# Altium schematic sheet Voeding.SchDoc: VoedingsSchema
size A4; DrawnBy: Jasper Maes; DocumentNumber: 2; Revision: /; SheetNumber: 2; SheetTotal: 4
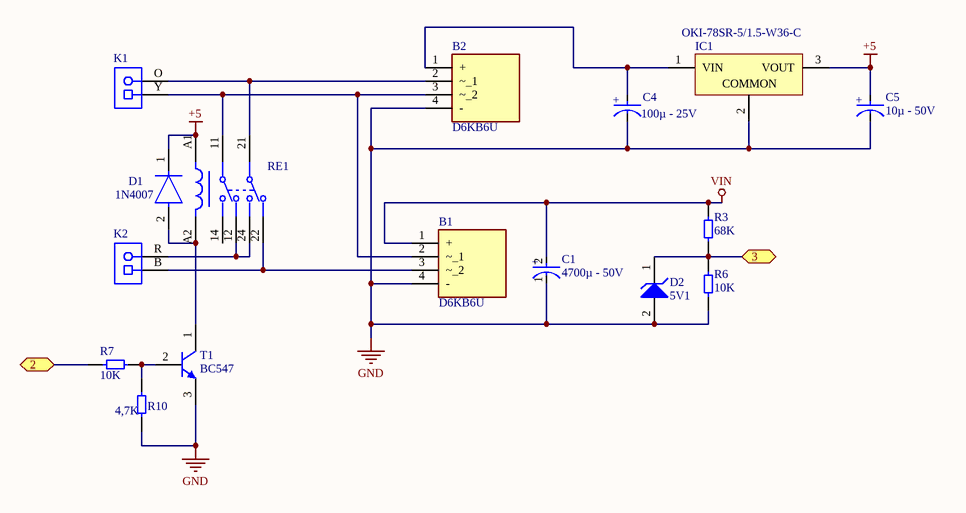
[diagram p0: Voeding.SchDoc]

## Parts
B1  D6KB6U  [GSIB1580E345]
B2  D6KB6U  [GSIB1580E345]
C1  4700µ - 50V  [U1-UU_NCH]
C4  100µ - 25V  [FP-RAD-TH-D_6_3_0_5-L_11-MFG]
C5  10µ - 50V  [CAPPRD200W52D525H1200]
D1  1N4007  [FP-1N4007-MFG]
D2  5V1  [FP-IR02-MFG]
IC1  OKI-78SR-5/1.5-W36-C  [MURA-OKI-78SR-3]
K1  1729128  [PHOE-1729128-2_V]  (value not drawn)
K2  1729128  [PHOE-1729128-2_V]  (value not drawn)
R3  68K  [RESC2013X60X40ML20T25]
R6  10K  [RESC2013X60X40ML20T25]
R7  10K  [RESC2013X60X40ML20T25]
R10  4,7K  [RESC2013X60X40ML20T25]
RE1  RT424005F  [FP-RT424005F-MFG]  (value not drawn)
T1  BC547  [ONSC-TO-92-3-29-11]

## Ports
2 (bidir, see Main_IC_Sheet[3C]), 3 (bidir, see Main_IC_Sheet[3B])

## Nets
+5: C5.2(A) D1.1(C) IC1.3(VOUT) RE1.A1
GND: B1.4(-) B2.4(-) C1.1(C) C4.1(C) C5.1(C) D2.2(A) IC1.2(COMMON) R6.2 R10.1 T1.3(E)
VIN: B1.1(+) C1.2(A) R3.2
2: R7.1 ; port 2
3: D2.1(K) R3.1 R6.1 ; port 3
NetB1_2: B1.2(~_1) B2.3(~_2) K1.Y RE1.11
NetB1_3: B1.3(~_2) K2.B RE1.22
NetB2_1: B2.1(+) C4.2(A) IC1.1(VIN)
NetB2_2: B2.2(~_1) K1.O RE1.21
NetD1_2: D1.2(A) RE1.A2 T1.1(C)
NetK2_R: K2.R RE1.12 RE1.24
NetR7_2: R7.2 R10.2 T1.2(B)

Not connected (* = marked no-connect by the designer): RE1 14

## Notes on the sheet
- (in symbol CMP-05427-000897-1) +

## Library data of the parts
B1 B2 = GSIB1580-E3_45: Bridge Rectifier Diode 15A 800V GSIB-5S; Manufacturer_Name: Vishay; Manufacturer_Part_Number: GSIB1580-E3/45; Geometry.Height: 20.3mm; Mouser Part Number: 625-GSIB1580-E3; Mouser Price/Stock: https://www.mouser.co.uk/ProductDetail/Vishay-General-Semiconductor/GSIB1580-E3-45?qs=NyKJzQ80QAwZu8Guxd36Tw%3D%3D; Datasheet Link: http://www.vishay.com/docs/88644/gsib15xx.pdf
C1 C4 C5 = CMP-05427-000897-1: Aluminum Electrolytic Capacitors (Radial Lead Type) 100uF ±20% 25V; ESR (Equivalent Series Resistance): 130mR; Ripple Current: 455mA; Polarity: Polar; Life (Hours): 2000Hour; Lead Diameter: 0.5mm; Tolerance: 20%; Radiation Hardening: No; Min Operating Temperature: -40°C; Series: FR; Max Operating Temperature: 105°C; Lead Free: Lead Free; Package Quantity: 2000; Capacitance: 100uF; Lead Pitch: 5mm; Voltage Rating (DC): 25V; Length: 11.2mm; Features: General Purpose; Mount: Through Hole; Voltage Rating: 25V; Case/Package: Radial; Impedance: 130mR; RoHS Compliant: Yes; Packaging: Tape and Reel; Height - Seated (Max): 0.441inch; Height: 11.2mm; Diameter: 6.3mm; Termination: Radial
D1 = CMP-123542-000001-1: Rectifier diode 1000 V 1 A DO-41, ,; Manufacturer: Diotec; Max Surge Forward Current: 27A; Forward Current: 1A; Max Junction Temp: +175°C; Reverse Voltage: 1000V; Value: 15pF; Peak Reverse Current: 5uA; Category: Diode; Temperature Range Low: -50°C; Automotive: No; Temperature: -50°C to +175°C; Lead Free: Yes; ComponentLink2Description: Datasheet; Max Repetitive Reverse Voltage: 1000V; ComponentLink2URL: https://datasheet.octopart.com/1N4007-Diotec-datasheet-62346875.pdf; Manufacturer Part Number: 1N4007; Device Class L3: Rectifier Diodes; Height: 2.8mm; Octopart: https://octopart.com/1n4007-diotec-4040411; Package: 1N4007; Temperature Range High: +175°C; Device Class L1: Discrete Semiconductors; Device Class L2: Diodes; RoHS: TRUE; Capacitance: 15pF; Ipc Land Pattern Name: DIOAD888W100L520D280
D2 = CMP-1060-00390-1: Zener Voltage Regulator, 500 mW, 2-Pin SOD-123, Pb-Free, Tape and Reel; Manufacturer: On Semiconductor; PartNumber: MMSZ4689ET1G; VZ Typ (V): 5.1; P Max (W): 0.5; ComponentLink3URL: http://www.onsemi.com/pub_link/Collateral/425-04.PDF; Packing: Tape and Reel; ComponentLink2Description: Datasheet; DatasheetVersion: Rev. 6; ComponentLink1Description: Manufacturer URL; ComponentLink1URL: http://www.onsemi.com/; RoHS: Pb-Free; PackageReference: SOD-123-2-425-04; PackageVersion: Rev. G, 10/2009; PackageDescription: 2-Pin SOD, Body 1.6 x 2.69 mm; ComponentLink2URL: http://www.onsemi.com/pub_link/Collateral/MMSZ4678ET1-D.PDF; Mounting Technology: Surface Mount; ComponentLink3Description: Package Specification
IC1 = CMP-2000-05274-1: Non-Isolated DC/DC Converter, 7.5 W, 7 to 36 V, 1.5 A, -40 to 85 degC, 3-Pin THD, RoHS; Manufacturer: Murata; Current - Output (Max): 1.5A; Power (Watts) - Max: 8W; Efficiency: 90.5%; Voltage - Input (Min): 7V; Voltage - Input (Max): 36V; Voltage - Output 1: 5V; Number of Outputs: 1; Package / Case: 3-SIPModule; Features: SCP; Type: LinearRegulatorReplacement; Size / Dimension: 0.41"Lx0.30"Wx0.65"H(10.4mmx7.6mmx16.5mm); Datasheet URL: https://datasheet.ciiva.com/8006/1790439-8006672.pdf; Datasheet Version: Oct-13; Power (Watts) - Manufacture Series: 8W; Voltage - Output 2: -; Series: Okami™OKI-78SR; Family: DCDCConverters; Manufacturer URL: http://www.murata.com/; Category: PowerSupplies-BoardMount; Voltage - Isolation: -; Packaging: Tube; Applications: ITE(Commercial); Mounting Type: ThroughHole; Voltage - Output 3: -; Operating Temperature: -40degC~85degC
K1 K2 = CMP-2000-05815-1: PCB Terminal Block, 13.5 A, 400 V, 2-Pin THD, RoHS, Bulk; Manufacturer: Phoenix Contact; Package Version: 03/2015; No. of Rows: 1; Pitch: 5.08mm; No. of Positions: 2; Voltage Rating: 400V; Current Rating: 13500mA; Manufacturer URL: http://www.phoenixcontact.com/; Datasheet URL: https://datasheet.ciiva.com/16046/1729128-16046181.pdf; RoHS: TRUE; Package URL: https://www.phoenixcontact.com/online/portal/pi/pxc/product_detail_page/!ut/p/b1/3VdJjqNKFDxLH8AFycySyWY2ozFsEPOMMQaDOX1XedGL_1Vdm5YXJleknhSKeBkvI6EA8ncAo3AYoDhBQGco6KN7VURTdemj9us_IEKEZo_YHiPAEWEFmDGOHMORkqKYCORBZxgL7ZoaZYcbFFUZ3fqxSY6GOuxydWUuHqz1ynmMFygu583Bob0Ewr6Sd_l-5m-kAueHiB0jpRwZwe58wwtkpxtMYd_LmGcDRU02dRNEyWt6Y2ti5pSyJ_reIkzIulrqApdnbT11V5jnCKbYNCvhEM1MCpPByat_X379-iThf08CI5GfOPqfBeS3BRoBOdD55AKVv0iLwCMq-2BrzXWSGRH7pUGD9uwXQjiph3xL0DKQwdGa0JImiIOmBNOestqgwTHSSs2oOep-78apyXQBvNi8ZLaFjvjWvcaUEBu0MC6Wbe-d6mB0FAebo2lUWinqYaZs5DAYzV0RP9yitUjnGJ0iI9xhZkT42OCQNUJJhkgWINNQLP2JFP6OpMg3JCVg70jqHT0lvKOnhHf0lPuOnnLf0VPuWx6_dxwUIvwk5WMkT0kLL1mh61l2yZVSzG3pYV_bqo-mj6uMKwKwdnnW8Jh5RTOJzMOA5c-eJDaZQw4mTMPH02PvS_ZAqNVjVTo2WyYLkwH_KU1mmmG5kjRhDqPXLwwVHvVOjCM60-fpXvTDfMGW1PVFVS1r4e4yVDk4ZdNbkUHvqPqQSeian4UD39fNKmachqdJ1NJbyk8rXT9mXTvPk3oE5meulKGgiruPJek-4I9hTT6G8ZLOyRSm2RRVbThERQad5OS28hdt4YW4vG0stgYYzsWsK4_7y6DZMjJSCqri1kyiZR5vD7pwIrNR7QwPHTcLTI5qT7eRlpHrdGiupYlqQDJ7zy_CND8fWWBoLRXxk1RVcXiBQwbTD4Xi7KL-FuO94t9xaqweXzH; PartNumber: 1729128; Package Description: 2-Pin Through Hole Device, Body 8.1 x 10.16 mm, Pitch 5.08 mm; Datasheet Version: 12/2013; Mounting Technology: ThroughHole; Orientation: Horizontal; Package Reference: 1729128-2; Packing: Bulk
R3 R6 R7 R10 = CMP-2001-00629-1_1: Part Number: ERA6AEB332V; Manufacturer: Panasonic
RE1 = CMP-03395-000296-1: RELAY GENERAL PURPOSE DPDT 8A 5V; Power Consumption: 400mW; Coil Current: 80.6mA; Max Voltage Rating (AC): 400V; Coil Power: 500mW; Dropout Voltage: 500mV; Operate Time: 7ms; Contact Voltage Rating (AC): 250V; Coil Type: Non-Latching; Coil Resistance: 62R; Release Time: 3ms; Max Operating Temperature: 85°C; Package Quantity: 5000; Relay Type: General Purpose; Series: RT2; Lead Free: Lead Free; Coil Voltage (DC): 5V; Contact Current Rating: 8A; Packaging: Carton; Height: 15.7mm; Mount: Through Hole; Width: 12.7mm; ELV: Compliant; Termination: PCB; Contact Material: Silver; Throw Configuration: DPDT; Min Operating Temperature: -40°C; Weight: 13g; RoHS Compliant: Yes; Length: 29mm; Radiation Hardening: No
T1 = CMP-1048-01464-1: Amplifier Transistor, NPN Silicon, 3-Pin TO-92, Pb-Free, Bulk Box; Manufacturer: On Semiconductor; PartNumber: BC547CG; IC Continuous (A): 0.1; fT Min (MHz): 150; ComponentLink3URL: http://www.onsemi.cn/pub_link/Collateral/2N6426-D.PDF; Mounting Technology: Through Hole; PackageReference: TO-92-3-29-11_AM_SL; ComponentLink2Description: Datasheet; RoHS: TRUE; Packing: Bulk Box; ComponentLink1Description: Manufacturer URL; PackageDescription: 3-Pin Transistor Outline, Body 4.825 x 3.685 mm, Pitch 1.27 mm; PackageVersion: Rev. AM; ComponentLink2URL: http://www.onsemi.com/pub_link/Collateral/BC546-D.PDF; ComponentLink3Description: Package Specification; ComponentLink1URL: http://www.onsemi.com/; DatasheetVersion: Rev. 7; Polarity: NPN